# EAGLE design ADIS16209_Teensy (EAGLE 9.5.0)
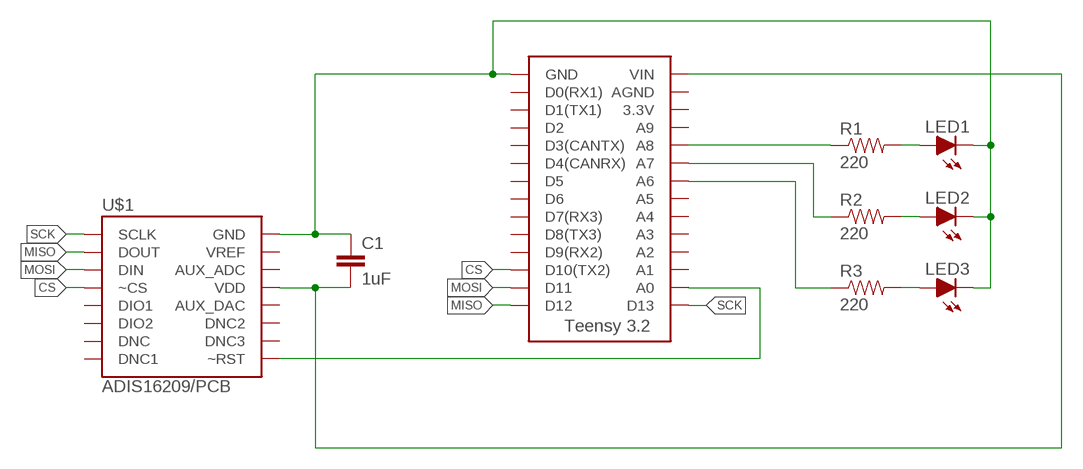
[diagram p0: schematic, sheet 1]

## Parts
C1  1uF  CAPKIT  [CAP-PTH-SMALL-KIT]
LED1  LED-5MM  [LED-5MM]
LED2  LED-5MM  [LED-5MM]
LED3  LED-5MM  [LED-5MM]
R1  220  RESISTORPTH-1/4W  [AXIAL-0.4]
R2  220  RESISTORPTH-1/4W  [AXIAL-0.4]
R3  220  RESISTORPTH-1/4W  [AXIAL-0.4]
U$1  ADIS16209/PCB  [ADIS16209/PCB]
U$2  TEENSY_3.2_SIMPLE  [TEENSY_3.2_SIMPLE]

## Nets
+3V3: C1.2 U$1.P$10(VDD) U$1.P$11(VDD) U$1.P$12(VDD) U$2.VIN
CS: U$1.P$3(~CS) U$2.D10(TX2)
GND: C1.1 LED1.K(C) LED2.K(C) LED3.K(C) U$1.P$7(GND) U$1.P$8(GND) U$1.P$14(GND) U$1.P$17(GND) U$2.GND
MISO: U$1.P$4(DOUT) U$2.D12
MOSI: U$1.P$6(DIN) U$2.D11
N$1: LED1.A R1.P$2
N$2: U$1.P$1(~RST) U$2.A0
N$3: R1.P$1 U$2.A8
N$4: R2.P$1 U$2.A7
N$5: R3.P$1 U$2.A6
N$6: LED2.A R2.P$2
N$7: LED3.A R3.P$2
SCK: U$1.P$2(SCLK) U$2.D13
Unconnected: U$1.P$5(VREF) U$1.P$9(VREF) U$1.P$13(AUX_ADC) U$1.P$15(AUX_DAC) U$1.P$16(VREF) U$1.P$18(VREF) U$1.P$19(DNC3) U$1.P$20(DNC2) U$1.P$21(DNC1) U$1.P$22(DNC) U$1.P$23(DIO2) U$1.P$24(DIO1) U$2.3.3V U$2.A1 U$2.A2 U$2.A3 U$2.A4 U$2.A5 U$2.A9 U$2.AGND U$2.D0(RX1) U$2.D1(TX1) U$2.D2 U$2.D3(CANTX) U$2.D4(CANRX) U$2.D5 U$2.D6 U$2.D7(RX3) U$2.D8(TX3) U$2.D9(RX2)

## Library data of the parts
C1 = HyTechDevices:CAP: Capacitor Standard 0603 ceramic capacitor, and 0.1" leaded capacitor.
LED1-LED3 = HyTechDevices:LED: Light Emitting Diode (LED) Source: Dangerous Prototypes Eagle Library <https://github.com/DangerousPrototypes/Eagle_Part_Library>
R1-R3 = HyTechDevices:RESISTOR: Resistor Basic schematic elements and footprints for 0603, 1206, and PTH resistors.
U$1 = HyTechDevices:ADIS16209: Analog Devices ADIS16209 High Accuracy, Dual-Axis Digital Inclinometer and Accelerometer
U$2 = HyTechDevices:TEENSY_3.2_SIMPLE: Simple version of the Teensy 3.2 board that only uses the 2 main rows of pins, not the inner pins or the pins opposite the usb port.

## Board
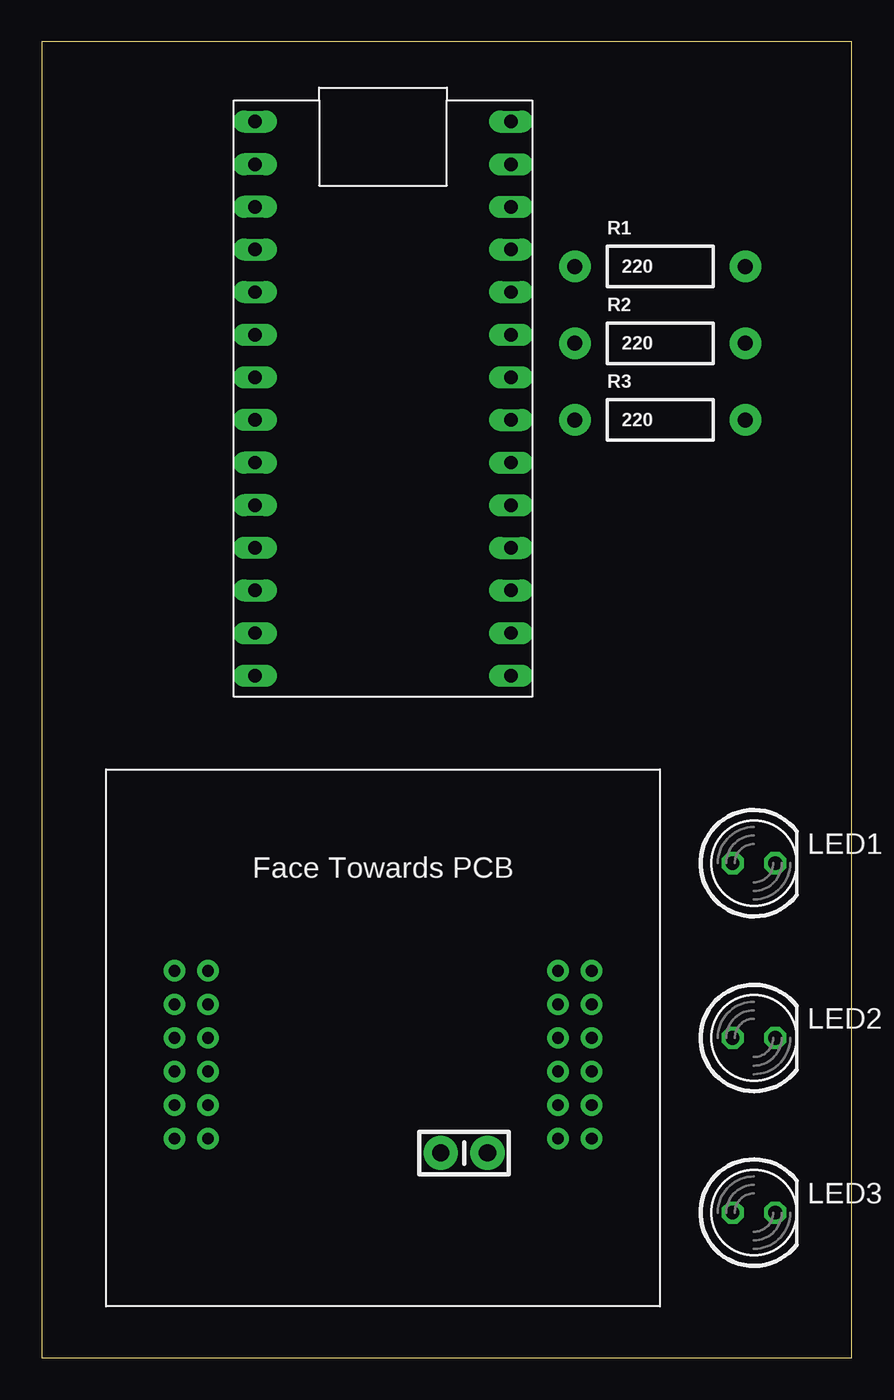
[diagram p1: board, top side]
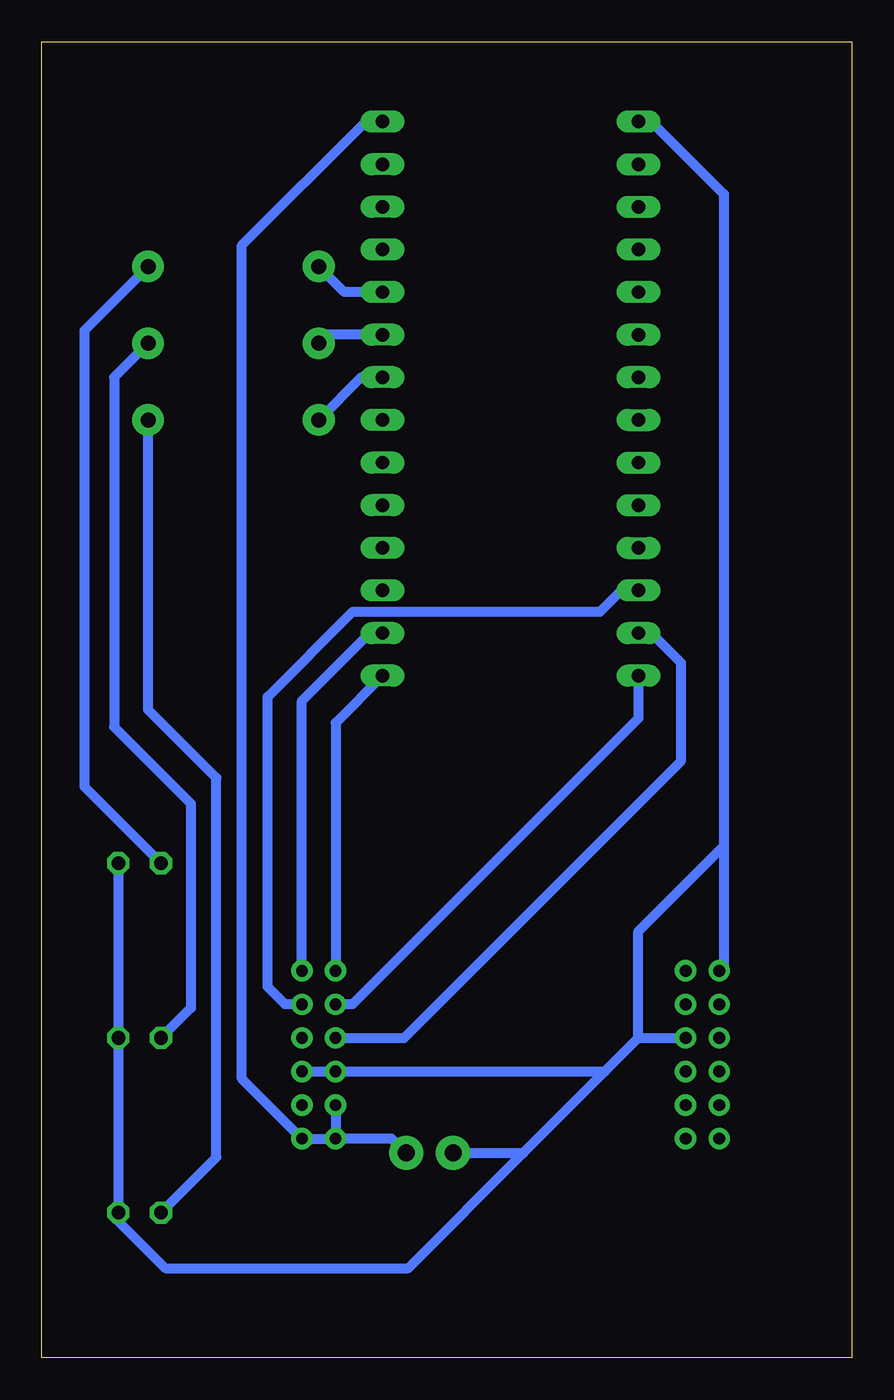
[diagram p2: board, bottom side, seen from below]

Size 48.24 x 78.41 mm. Coordinates in mm from the lower left corner, seen from the top.
Outline: 0,0 48.24,0 48.24,78.41 0,78.41 0,0
Copper layers (1*16): Top 0.035mm / dielectric 1.5mm / Bottom 0.035mm
Design rules "default": minimum track width 6mil, minimum drill 0.35mm, track to track 6mil, track to pad 6mil, pad to pad 6mil, via to via 6mil, smd to smd 6mil, copper to edge 40mil, drill to drill 6mil, minimum pad ring 10mil, minimum via ring 8mil, stop-mask expansion 4mil, vias tented up to drill 0mil, thermal gap 10mil

### Footprints (pad centres in the part's own frame; a part is rotated, then mirrored left to right if it is on the bottom)
CAP-PTH-SMALL-KIT = drill 1.016 pad 2.032: 1 -1.397,0; 2 1.397,0
LED-5MM = drill 0.813 octagon: A -1.27,0; K 1.27,0
AXIAL-0.4 = drill 0.9 pad 1.88: P$1 -5.08,0; P$2 5.08,0
ADIS16209/PCB = drill 0.7 pad 1.27: P$1 12.43,4; P$2 10.43,4; P$3 12.43,2; P$4 10.43,2; P$5 12.43,0; P$6 10.43,0; P$7 12.43,-2; P$8 10.43,-2; P$9 12.43,-4; P$10 10.43,-4; P$11 12.43,-6; P$12 10.43,-6; P$13 -10.43,4; P$14 -12.43,4; P$15 -10.43,2; P$16 -12.43,2; P$17 -10.43,0; P$18 -12.43,0; P$19 -10.43,-2; P$20 -12.43,-2; P$21 -10.43,-4; P$22 -12.43,-4; P$23 -10.43,-6; P$24 -12.43,-6
TEENSY_3.2_SIMPLE = drill 0.8 long: 3.3V 16.51,29.21; A0 16.51,3.81; A1 16.51,6.35; A2 16.51,8.89; A3 16.51,11.43; A4 16.51,13.97; A5 16.51,16.51; A6 16.51,19.05; A7 16.51,21.59; A8 16.51,24.13; A9 16.51,26.67; AGND 16.51,31.75; D0(RX1) 1.27,31.75; D1(TX1) 1.27,29.21; D2 1.27,26.67; D3(CANTX) 1.27,24.13; D4(CANRX) 1.27,21.59; D5 1.27,19.05; D6 1.27,16.51; D7(RX3) 1.27,13.97; D8(TX3) 1.27,11.43; D9(RX2) 1.27,8.89; D10(TX2) 1.27,6.35; D11 1.27,3.81; D12 1.27,1.27; D13 16.51,1.27; GND 1.27,34.29; VIN 16.51,34.29

### Placement (x,y rotation side)
C1  25.15,12.19 0 top
LED1  42.42,29.46 0 top
LED2  42.42,19.05 0 top
LED3  42.42,8.64 0 top
R1  36.83,65.02 0 top
R2  36.83,60.45 0 top
R3  36.83,55.88 0 top
U$1  20.32,19.05 0 top
U$2  11.43,39.37 0 top

### Tracks (layer width: path | path; a pad name or v marks a point on that pad's centre or on a via)
+3V3
  Bottom 0.61: U$1.P$10 U$1.P$12 | U$1.P$12 U$1.P$11 36.32,16.62 36.32,66.29 28.96,73.66 U$2.VIN | C1.2 27.4,13.05 U$1.P$12
CS
  Bottom 0.61: U$1.P$3 33.75,21.05 34.8,22.1 34.8,39.37 29.72,44.45 14.99,44.45 13.72,45.72 U$2.D10(TX2)
GND
  Bottom 0.61: U$1.P$7 U$1.P$8 14.7,17.05 | 14.7,17.05 12.7,19.05 | 12.7,19.05 U$1.P$17 | 12.7,19.05 12.7,25.4 7.62,30.48 | U$2.GND 11.94,73.66 7.62,69.34 7.62,30.48 | LED1.K LED2.K LED3.K 43.69,8.13 40.89,5.33 26.42,5.33 19.56,12.19 | 19.56,12.19 14.7,17.05 | 7.62,30.48 7.62,23.32 U$1.P$14 | C1.1 19.56,12.19
MISO
  Bottom 0.61: U$2.D12 12.7,38.1 29.75,21.05 U$1.P$4
MOSI
  Bottom 0.61: U$1.P$6 26.67,19.05 10.16,35.56 10.16,41.4 11.94,43.18 U$2.D11
N$1
  Bottom 0.61: R1.P$2 45.72,61.21 45.72,34.04 LED1.A
N$2
  Bottom 0.61: U$1.P$1 32.75,39.13 28.7,43.18 U$2.A0
N$3
  Bottom 0.61: U$2.A8 30.23,63.5 R1.P$1
N$4
  Bottom 0.61: U$2.A7 31.24,60.96 R2.P$1
N$5
  Bottom 0.61: U$2.A6 29.21,58.42 R3.P$1
N$6
  Bottom 0.61: R2.P$2 43.94,58.42 43.94,37.59 39.37,33.02 39.37,20.83 LED2.A
N$7
  Bottom 0.61: LED3.A 37.85,11.94 37.85,34.54 41.91,38.61 R3.P$2
SCK
  Bottom 0.61: U$2.D13 30.75,37.83 U$1.P$2